# Altium schematic sheet 激光雕刻机电路连接图.SchDoc
size A4
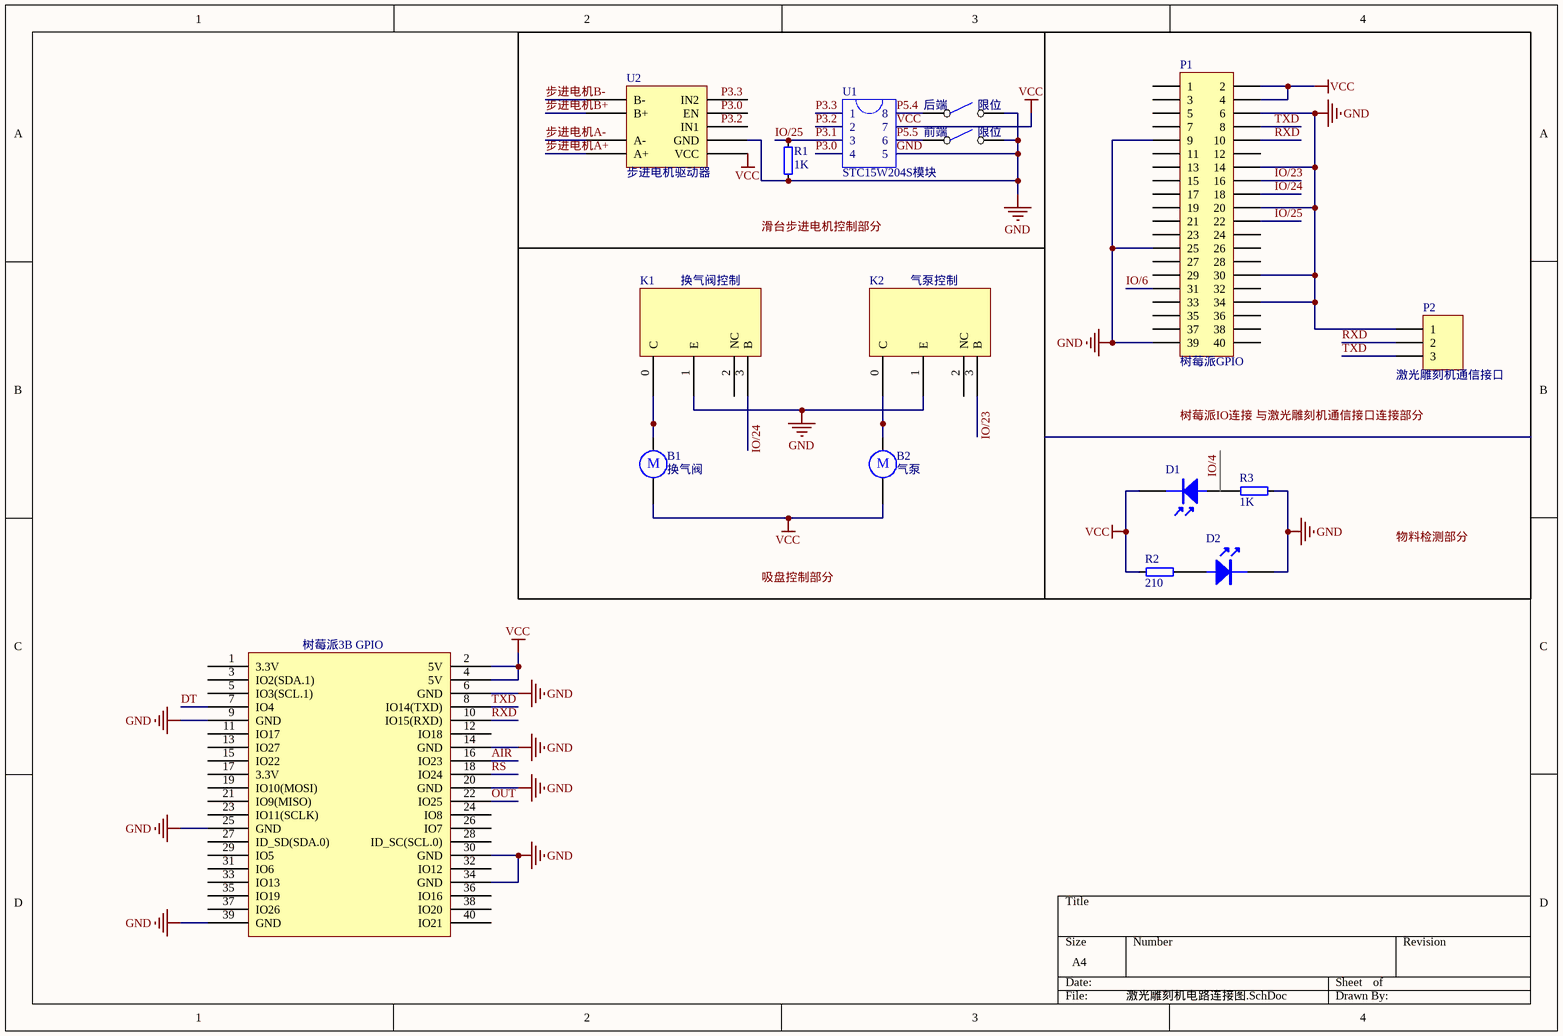
[diagram p0: 激光雕刻机电路连接图.SchDoc]

## Parts
*  树莓派3B GPIO
B1  换气阀  [RB5-10.5]
B2  气泵  [RB5-10.5]
D1  (no value)
D2  (no value)  [DIODE0.4A]
K1  换气阀控制
K2  气泵控制
P1  树莓派GPIO  [HDR2X20]
P2  激光雕刻机通信接口  [HDR1X3]
R1  1K  [AXIAL0.3]
R2  210  [AXIAL0.3]
R3  1K  [AXIAL0.3]
U1  STC15W204S模块
U2  步进电机驱动器
前端  限位
后端  限位

## Nets
GND: *.6(GND) *.9(GND) *.14(GND) *.20(GND) *.25(GND) *.30(GND) *.34(GND) *.39(GND) D2.K K1.1(E) K2.1(E) P1.6 P1.9 P1.14 P1.20 P1.25 P1.30 P1.34 P1.39 P2.1 R1.2 R3.1 U1.5 U2.5(GND) 前端.2 后端.2
VCC: *.2(5V) *.4(5V) B1.2 B2.2 D1.2(K) P1.2 P1.4 R2.2 U1.7 U2.4(VCC)
AIR: *.16(IO23)
DT: *.7(IO4)
IO/6: P1.31
IO/23: K2.3(B) P1.16
IO/24: K1.3(B) P1.18
IO/25: P1.22 R1.1 U1.3  [also labelled P3.1]
OUT: *.22(IO25)
P3.0: U1.4
P3.2: U1.2
P3.3: U1.1
RS: *.18(IO24)
RXD: *.10(IO15(RXD)) P1.10 P2.2
TXD: *.8(IO14(TXD)) P1.8 P2.3
步进电机A+: U2.9(A+)
步进电机A-: U2.10(A-)
步进电机B+: U2.11(B+)
步进电机B-: U2.12(B-)
NetB1_1: B1.1 K1.0(C)
NetB2_1: B2.1 K2.0(C)
NetD1_1: D1.1(A) R3.2
NetD2_A: D2.A R2.1
NetU1_6: U1.6 前端.1
NetU1_8: U1.8 后端.1

Not connected (* = marked no-connect by the designer): * 1(3.3V) 3(IO2(SDA.1)) 5(IO3(SCL.1)) 11(IO17) 12(IO18) 13(IO27) 15(IO22) 17(3.3V) 19(IO10(MOSI)) 21(IO9(MISO)) 23(IO11(SCLK)) 24(IO8) 26(IO7) 27(ID_SD(SDA.0)) 28(ID_SC(SCL.0)) 29(IO5) 31(IO6) 32(IO12) 33(IO13) 35(IO19) 36(IO16) 37(IO26) 38(IO20) 40(IO21); K1 2(NC); K2 2(NC); P1 1 3 5 7 11 12 13 15 17 19 21 23 24 26 27 28 29 32 33 35 36 37 38 40; U2 6(IN1) 7(EN) 8(IN2)

## Notes on the sheet
- Labels drawn without touching a wire or pin: GND, P3.0, P3.2, P3.3, P5.4, P5.5, VCC, 吸盘控制部分, 树莓派IO连接 与激光雕刻机通信接口连接部分, 滑台步进电机控制部分, 物料检测部分
- (in symbol Motor) M

## Library data of the parts
* = 树莓派gpio
B1 B2 = Motor: Motor, General Kind; Published: 24-Mar-1999; LatestRevisionDate: 17-Jul-2002; LatestRevisionNote: Re-released for DXP Platform.; PackageReference: RB5-10.5; Publisher: Altium Limited; PackageDescription: Capacitor (Radial); 2 Leads
D1 = 光敏二极管: Photosensitive Diode
D2 = 发光二极管
K1 K2 = 固态继电器
P1 = Header 20X2: Header, 20-Pin, Dual row; LatestRevisionDate: 17-Jul-2002; LatestRevisionNote: Re-released for DXP Platform.; Publisher: Altium Limited
P2 = Header 3: Header, 3-Pin; LatestRevisionDate: 17-Jul-2002; LatestRevisionNote: Re-released for DXP Platform.; Publisher: Altium Limited
R1-R3 = RES
U1 = 8PIN
前端 后端 = 单刀开关